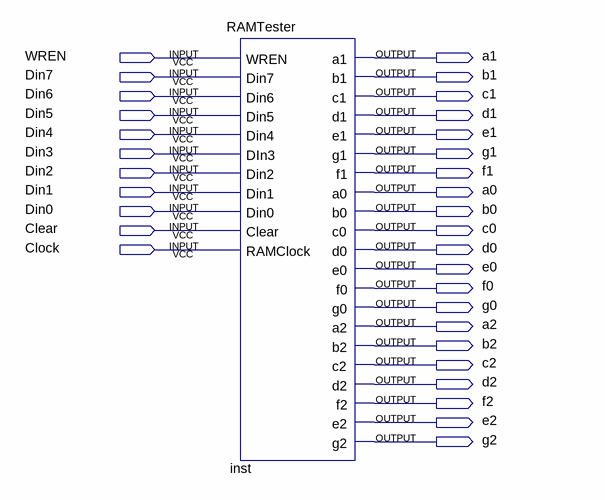
[diagram p0: schematic sheet]
// Quartus schematic Block1.bdf as structural Verilog: 1 symbols, 32 pins
module Block1 (
  input  WREN,
  input  Din7,
  input  Din6,
  input  Din5,
  input  Din4,
  input  Din3,
  input  Din2,
  input  Din1,
  input  Din0,
  input  Clear,
  input  Clock,
  output a1,
  output b1,
  output c1,
  output d1,
  output e1,
  output g1,
  output f1,
  output a0,
  output b0,
  output c0,
  output d0,
  output e0,
  output f0,
  output g0,
  output a2,
  output b2,
  output c2,
  output d2,
  output f2,
  output e2,
  output g2
);

  RAMTester inst (
    .WREN(WREN), .Din7(Din7), .Din6(Din6), .Din5(Din5), .Din4(Din4), .DIn3(Din3), .Din2(Din2), .Din1(Din1),
    .Din0(Din0), .Clear(Clear), .RAMClock(Clock), .a1(a1), .b1(b1), .c1(c1), .d1(d1), .e1(e1), .g1(g1),
    .f1(f1), .a0(a0), .b0(b0), .c0(c0), .d0(d0), .e0(e0), .f0(f0), .g0(g0), .a2(a2), .b2(b2), .c2(c2),
    .d2(d2), .f2(f2), .e2(e2), .g2(g2));
endmodule
